# Altium schematic sheet Sheet1.SchDoc
size A4
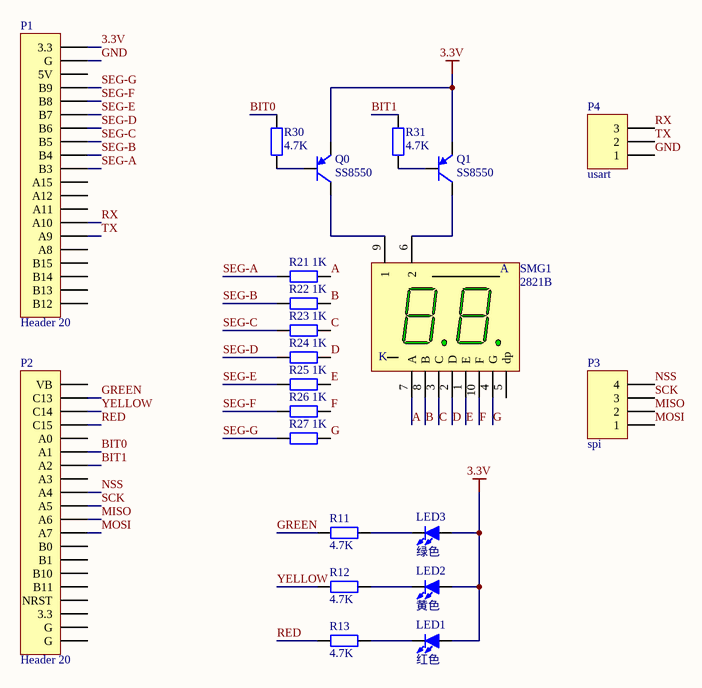
[diagram p0: Sheet1.SchDoc]

## Parts
LED1  红色  [LED 0805G]
LED2  黄色  [LED 0805G]
LED3  绿色  [LED 0805G]
P1  Header 20  [HDR1X20]
P2  Header 20  [HDR1X20]
P3  spi  [HDR1X4]
P4  usart  [HDR1X3]
Q0  SS8550  [SOT23-3N]
Q1  SS8550  [SOT23-3N]
R11  4.7K  [R 0805]
R12  4.7K  [R 0805]
R13  4.7K  [R 0805]
R21  1K  [R 0805]
R22  1K  [R 0805]
R23  1K  [R 0805]
R24  1K  [R 0805]
R25  1K  [R 0805]
R26  1K  [R 0805]
R27  1K  [R 0805]
R30  4.7K  [R 0805]
R31  4.7K  [R 0805]
SMG1  2821B  [SMG 0.28-2P]

## Nets
3.3V: LED1.1(A) LED2.1(A) LED3.1(A) P1.20(3.3) Q0.2(E) Q1.2(E)
A: R21.2 SMG1.7(A)
B: R22.2 SMG1.8(B)
BIT0: P2.15(A1) R30.2
BIT1: P2.14(A2) R31.2
C: R23.2 SMG1.3(C)
D: R24.2 SMG1.2(D)
E: R25.2 SMG1.1(E)
F: R26.2 SMG1.10(F)
G: R27.2 SMG1.4(G)
GND: P1.19(G) P4.1
GREEN: P2.19(C13) R11.1
MISO: P2.10(A6) P3.2
MOSI: P2.9(A7) P3.1
NSS: P2.12(A4) P3.4
RED: P2.17(C15) R13.1
RX: P1.7(A10) P4.3
SCK: P2.11(A5) P3.3
SEG-A: P1.11(B3) R21.1
SEG-B: P1.12(B4) R22.1
SEG-C: P1.13(B5) R23.1
SEG-D: P1.14(B6) R24.1
SEG-E: P1.15(B7) R25.1
SEG-F: P1.16(B8) R26.1
SEG-G: P1.17(B9) R27.1
TX: P1.6(A9) P4.2
YELLOW: P2.18(C14) R12.1
NetLED1_2: LED1.2(K) R13.2
NetLED2_2: LED2.2(K) R12.2
NetLED3_2: LED3.2(K) R11.2
NetQ0_1: Q0.1(B) R30.1
NetQ0_3: Q0.3(C) SMG1.9(1)
NetQ1_1: Q1.1(B) R31.1
NetQ1_3: Q1.3(C) SMG1.6(2)

Not connected (* = marked no-connect by the designer): P1 1(B12) 2(B13) 3(B14) 4(B15) 5(A8) 8(A11) 9(A12) 10(A15) 18(5V); P2 1(G) 2(G) 3(3.3) 4(NRST) 5(B11) 6(B10) 7(B1) 8(B0) 13(A3) 16(A0) 20(VB); SMG1 5(dp)

## Notes on the sheet
- (in symbol 2821B) K

## Library data of the parts
LED1-LED3 = LED-SMD: 贴片LED; 版权归属: 源创客; BOM名称: 贴片LED; 学习资源: www.ooocke.com
P1 P2 = Header 20: Header, 20-Pin; LatestRevisionDate: 17-Jul-2002; LatestRevisionNote: Re-released for DXP Platform.; Publisher: Altium Limited
P3 = Header 4: Header, 4-Pin; LatestRevisionDate: 17-Jul-2002; LatestRevisionNote: Re-released for DXP Platform.; Publisher: Altium Limited
P4 = Header 3: Header, 3-Pin; LatestRevisionDate: 17-Jul-2002; LatestRevisionNote: Re-released for DXP Platform.; Publisher: Altium Limited
Q0 Q1 = 8550-SMD: 高频放大-PNP型; 版权归属: 源创客; 属性: 40V 1.5A 1W 100MHZ; BOM名称: 高频放大-PNP型; 学习资源: www.ooocke.com
R11-R13 R21-R27 R30 R31 = R: 贴片电阻; 版权归属: 源创客; BOM名称: 贴片电阻; 学习资源: www.ooocke.com
SMG1 = 2821B: 0.28寸2位共阳数码管; 版权归属: 源创客; BOM名称: 0.28寸2位共阳; 学习资源: www.ooocke.com